# Altium schematic sheet ChargerDeviceSchematic.SchDoc
size A0
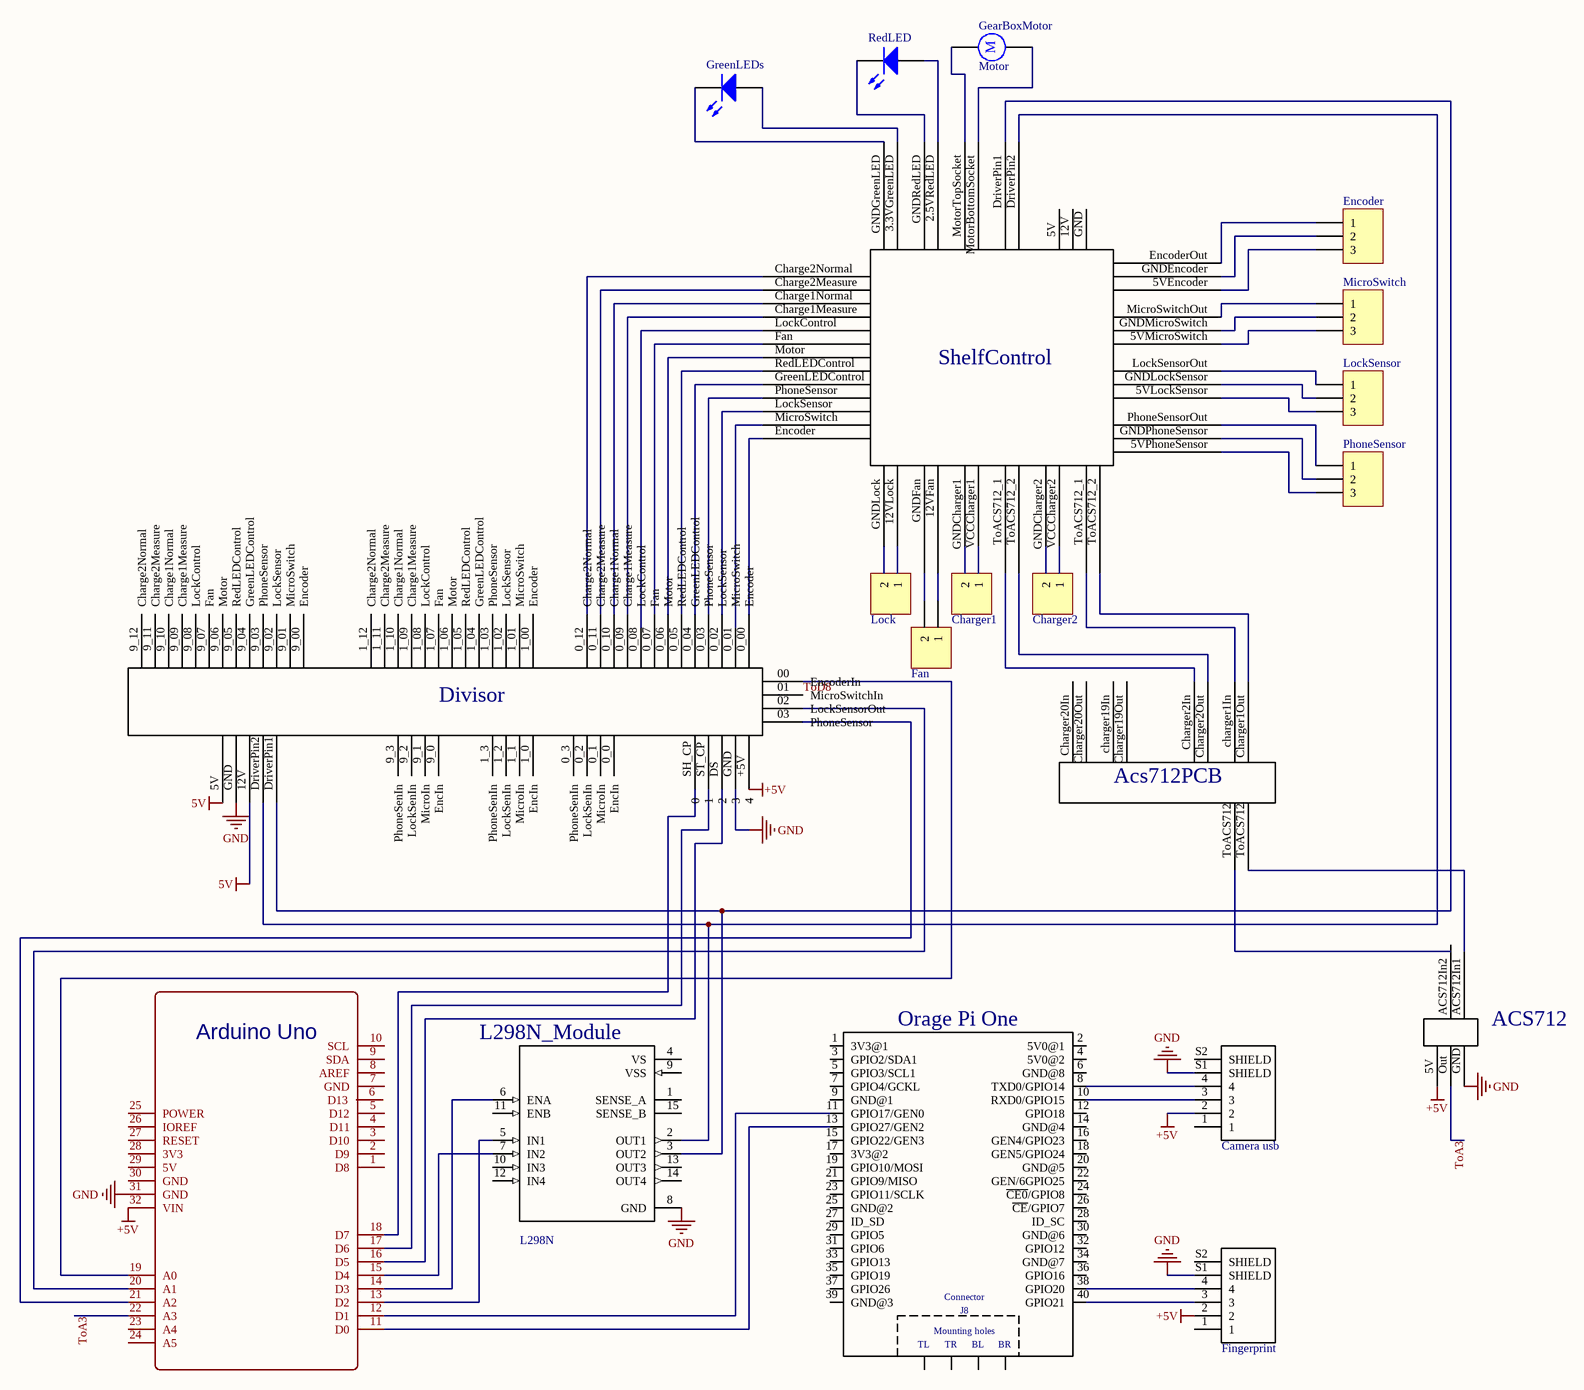
[diagram p0: ChargerDeviceSchematic.SchDoc]

## Parts
ACS712  (no value)  [CBB22]
Acs712PCB  (no value)  [CBB22]
Arduino_Uno  (no value)  [UNO_R3]
Camera_usb  1-292303-1  [*TE_1-292303-1_1-292303-1(Primary)]  (value not drawn)
Charger1  (no value)  [HDR1X2]
Charger2  (no value)  [HDR1X2]
Divisor  (no value)  [CBB22]
Encoder  (no value)  [HDR1X3]
Fan  (no value)  [HDR1X2]
Fingerprint  1-292303-1  [*TE_1-292303-1_1-292303-1(Primary)]  (value not drawn)
GearBoxMotor  Motor  [RB5-10.5]
GreenLEDs  (no value)  [3.2X1.6X1.1]
L298N_Module  L298N  [*TO127P2020X500X2100-15]
Lock  (no value)  [HDR1X2]
LockSensor  (no value)  [HDR1X3]
MicroSwitch  (no value)  [HDR1X3]
Orage_Pi_One  (no value)  [*RASPBERRY_PI_B+_RASPBERRY_PI_B+(Primary)]
PhoneSensor  (no value)  [HDR1X3]
RedLED  (no value)  [3.2X1.6X1.1]
ShelfControl  (no value)  [CBB22]

## Nets
+5V: Arduino_Uno.32(VIN) Camera_usb.2 Fingerprint.2
GND: Arduino_Uno.31(GND) Camera_usb.S1(SHIELD) Fingerprint.S1(SHIELD) L298N_Module.8(GND)
ToA3: Arduino_Uno.22(A3)
NetArduino_Uno_11: Arduino_Uno.11(D0) Orage_Pi_One.13(GPIO27/GEN2)
NetArduino_Uno_12: Arduino_Uno.12(D1) Orage_Pi_One.11(GPIO17/GEN0)
NetArduino_Uno_13: Arduino_Uno.13(D2) L298N_Module.5(IN1)
NetArduino_Uno_14: Arduino_Uno.14(D3) L298N_Module.6(ENA)
NetArduino_Uno_15: Arduino_Uno.15(D4) L298N_Module.7(IN2)
NetCamera_usb_3: Camera_usb.3 Orage_Pi_One.10(RXD0/GPIO15)
NetCamera_usb_4: Camera_usb.4 Orage_Pi_One.8(TXD0/GPIO14)
NetCharger1_1: Charger1.1 ShelfControl.VCCCharger1
NetCharger1_2: Charger1.2 ShelfControl.GNDCharger1
NetCharger2_1: Charger2.1 ShelfControl.VCCCharger2
NetCharger2_2: Charger2.2 ShelfControl.GNDCharger2
NetFan_1: Fan.1 ShelfControl.12VFan
NetFan_2: Fan.2 ShelfControl.GNDFan
NetFingerprint_3: Fingerprint.3 Orage_Pi_One.40(GPIO21)
NetFingerprint_4: Fingerprint.4 Orage_Pi_One.38(GPIO20)
NetLock_1: Lock.1 ShelfControl.12VLock
NetLock_2: Lock.2 ShelfControl.GNDLock

Not connected (* = marked no-connect by the designer): ACS712 5V ACS712In1 ACS712In2 GND Out; Acs712PCB charger1In Charger1Out Charger2In Charger2Out charger19In Charger19Out Charger20In Charger20Out ToACS712; Arduino_Uno 1(D8) 2(D9) 3(D10) 4(D11) 5(D12) 6(D13) 7(GND) 8(AREF) 9(SDA) 10(SCL) 16(D5) 17(D6) 18(D7) 19(A0) 20(A1) 21(A2) 23(A4) 24(A5) 25(POWER) 26(IOREF) 27(RESET) 28(3V3) 29(5V) 30(GND); Camera_usb 1 S2(SHIELD); Divisor 00(EncoderIn) 0_00(Encoder) 0_0(EncIn) 0_01(MicroSwitch) 0_1(MicroIn) 0_02(LockSensor) 0_2(LockSenIn) 0_03(PhoneSensor) 0_3(PhoneSenIn) 0_04(GreenLEDControl) 0_05(RedLEDControl) 0_06(Motor) 0_07(Fan) 0_08(LockControl) 0_09(Charge1Measure) 0_10(Charge1Normal) 0_11(Charge2Measure) 0_12(Charge2Normal) 01(MicroSwitchIn) 1_00(Encoder) 1_0(EncIn) 1_01(MicroSwitch) 1_1(MicroIn) 1_02(LockSensor) 1_2(LockSenIn) 1_03(PhoneSensor) 1_3(PhoneSenIn) 1_04(GreenLEDControl) 1_05(RedLEDControl) 1_06(Motor) 1_07(Fan) 1_08(LockControl) 1_09(Charge1Measure) 1_10(Charge1Normal) 1_11(Charge2Measure) 1_12(Charge2Normal) 02(LockSensorOut) 03(PhoneSensor) 5V 9_00(Encoder) 9_0(EncIn) 9_01(MicroSwitch) 9_1(MicroIn) 9_02(LockSensor) 9_2(LockSenIn) 9_03(PhoneSensor) 9_3(PhoneSenIn) 9_04(GreenLEDControl) 9_05(RedLEDControl) 9_06(Motor) 9_07(Fan) 9_08(LockControl) 9_09(Charge1Measure) 9_10(Charge1Normal) 9_11(Charge2Measure) 9_12(Charge2Normal) 12V +5V(4) DriverPin1 DriverPin2 DS(2) GND(3) SH_CP(0) ST_CP(1); Encoder 1 2 3; Fingerprint 1 S2(SHIELD); GearBoxMotor 1 2; GreenLEDs 1(A) 2(K); L298N_Module 1(SENSE_A) 2(OUT1) 3(OUT2) 4(VS) 9(VSS) 10(IN3) 11(ENB) 12(IN4) 13(OUT3) 14(OUT4) 15(SENSE_B); LockSensor 1 2 3; MicroSwitch 1 2 3; Orage_Pi_One 1(3V3@1) 2(5V0@1) 3(GPIO2/SDA1) 4(5V0@2) 5(GPIO3/SCL1) 6(GND@8) 7(GPIO4/GCKL) 9(GND@1) 12(GPIO18) 14(GND@4) 15(GPIO22/GEN3) 16(GEN4/GPIO23) 17(3V3@2) 18(GEN5/GPIO24) 19(GPIO10/MOSI) 20(GND@5) 21(GPIO9/MISO) 22(GEN/6GPIO25) 23(GPIO11/SCLK) 24(~{CE0}/GPIO8) 25(GND@2) 26(~{CE}/GPIO7) 27(ID_SD) 28(ID_SC) 29(GPIO5) 30(GND@6) 31(GPIO6) 32(GPIO12) 33(GPIO13) 34(GND@7) 35(GPIO19) 36(GPIO16) 37(GPIO26) 39(GND@3) PE_BL(BL) PE_BR(BR) PE_TL(TL) PE_TR(TR); PhoneSensor 1 2 3; RedLED 1(A) 2(K); ShelfControl 2.5VRedLED 3.3VGreenLED 5V 5VEncoder 5VLockSensor 5VMicroSwitch 5VPhoneSensor 12V Charge1Measure Charge1Normal Charge2Measure Charge2Normal DriverPin1 DriverPin2 Encoder EncoderOut Fan GND GNDEncoder GNDGreenLED GNDLockSensor GNDMicroSwitch GNDPhoneSensor GNDRedLED GreenLEDControl LockControl LockSensor LockSensorOut MicroSwitch MicroSwitchOut Motor MotorBottomSocket MotorTopSocket PhoneSensor PhoneSensorOut RedLEDControl ToACS712_1 ToACS712_2

## Notes on the sheet
- Labels drawn without touching a wire or pin: 5V, +5V, GND, ToD8
- (in symbol Motor) M
- (in symbol RASPBERRY_PI_B+) Connector; J8; Mounting holes

## Library data of the parts
ACS712 Acs712PCB Divisor ShelfControl = Component_1: Polypropylene film with epoxy Cap CBB22 105J400V; Manufacturer: CHINA; Designer: Abbas Basereh; Data: 16-12-2016; Link: https://www.alibaba.com/product-detail/CBB22-capacitors-105J-400V-1UF-400V_60020643516.html; Part. No: 105J400V
Arduino_Uno = UNO_R3: sourceId: 1T5FDZYC8; timeStamp: 1460354705; BOM_Manufacturer Part: ?; spicePre: P
Camera_usb Fingerprint = 1-292303-1: Conn USB 2.0 Type A RCP 4 POS Solder RA SMD 4 Terminal 1 Port Box/Tray; MF: TE Connectivity; TE_purchase_URL: https://www.te.com/usa-en/product-1-292303-1.html?te_bu=Cor&te_type=disp&te_campaign=seda_glo_cor-seda-global-disp-prtnr-fy19-seda-model-bom-cta_sma-317_1&elqCampaignId=32493; SnapEDA_Link: https://www.snapeda.com/parts/1-292303-1/TE%20Connectivity%20AMP%20Connectors/view-part/?ref=snap; MP: 1-292303-1; Availability: Unavailable; Price: None; EU_RoHS_Compliance: Compliant; Package: None; Value: *
Charger1 Charger2 Fan Lock = Header 2: Header, 2-Pin; LatestRevisionDate: 17-Jul-2002; LatestRevisionNote: Re-released for DXP Platform.; Publisher: Altium Limited
Encoder LockSensor MicroSwitch PhoneSensor = Header 3: Header, 3-Pin; LatestRevisionDate: 17-Jul-2002; LatestRevisionNote: Re-released for DXP Platform.; Publisher: Altium Limited
GearBoxMotor = Motor: Motor, General Kind; Published: 24-Mar-1999; LatestRevisionDate: 17-Jul-2002; LatestRevisionNote: Re-released for DXP Platform.; PackageReference: RB5-10.5; Publisher: Altium Limited; PackageDescription: Capacitor (Radial); 2 Leads
GreenLEDs RedLED = LED2: Typical RED, GREEN, YELLOW, AMBER GaAs LED; Published: 8-Jun-2000; LatestRevisionDate: 17-Jul-2002; LatestRevisionNote: Re-released for DXP Platform.; PackageVersion: Feb-2002; PackageReference: 3.2X1.6X1.1; Publisher: Altium Limited; PackageDescription: SM LED; 2 Flat Leads
L298N_Module = L298N: Dual Full Bridge Motor Driver 15-Pin_15+Tab_ MULTIWATT V Tube; MF: STMicroelectronics; Availability: Unavailable; MP: L298N; Package: Multiwatt-15 STMicroelectronics; SnapEDA_Link: https://www.snapeda.com/parts/L298N/STMicroelectronics/view-part/?ref=snap; Price: None; Value: *
Orage_Pi_One = RASPBERRY_PI_B+: Single Board Computer; 700Mhz; 512Mb RAM; 85.6x53.98x17mm; Raspberry Pi B+ Series; Availability: Unavailable; Price: None; SnapEDA_Link: https://www.snapeda.com/parts/RASPBERRY%20PI%20B%2B/Raspberry%20Pi/view-part/?ref=snap; MF: Raspberry Pi; MP: RASPBERRY PI B+; Package: None; Value: *